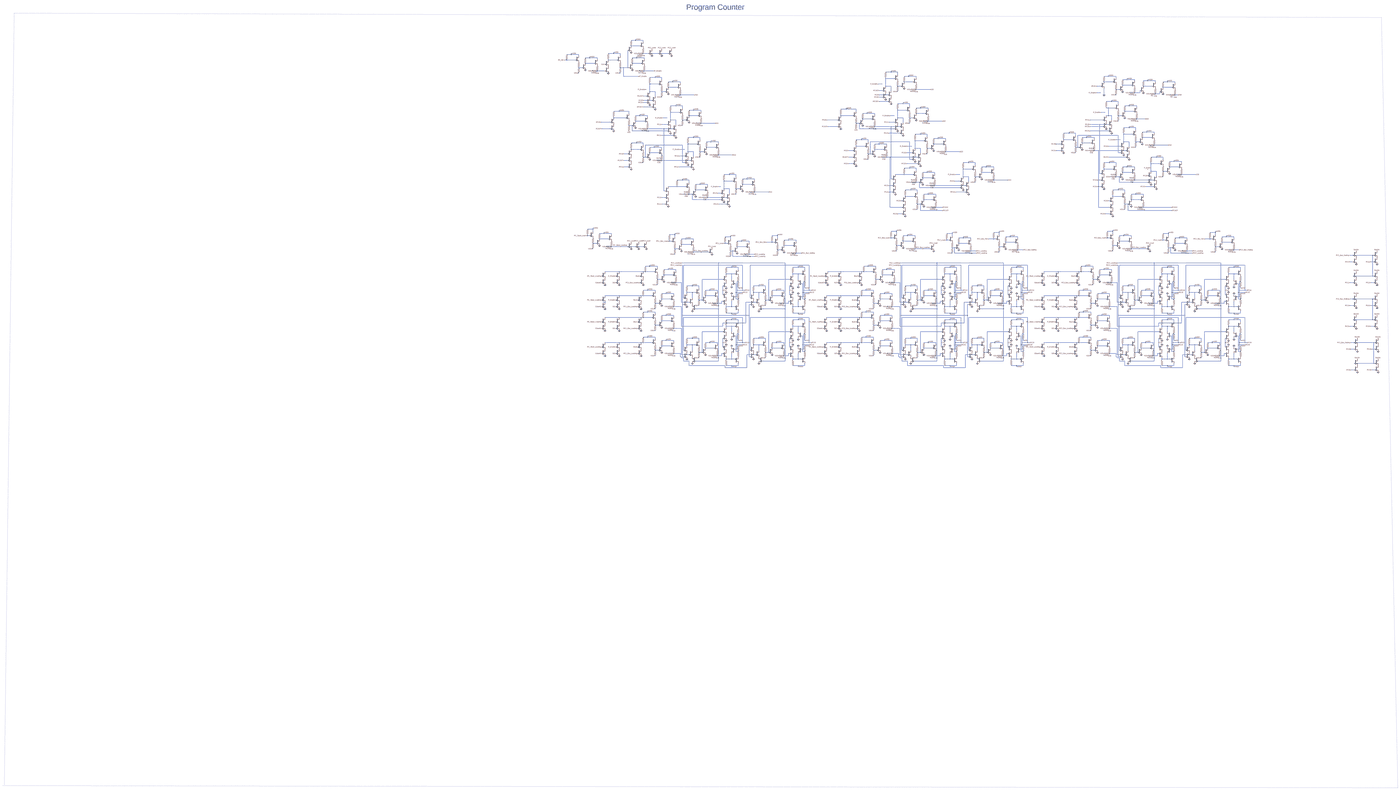
[diagram p0: schematic program_counter.asc, whole sheet]
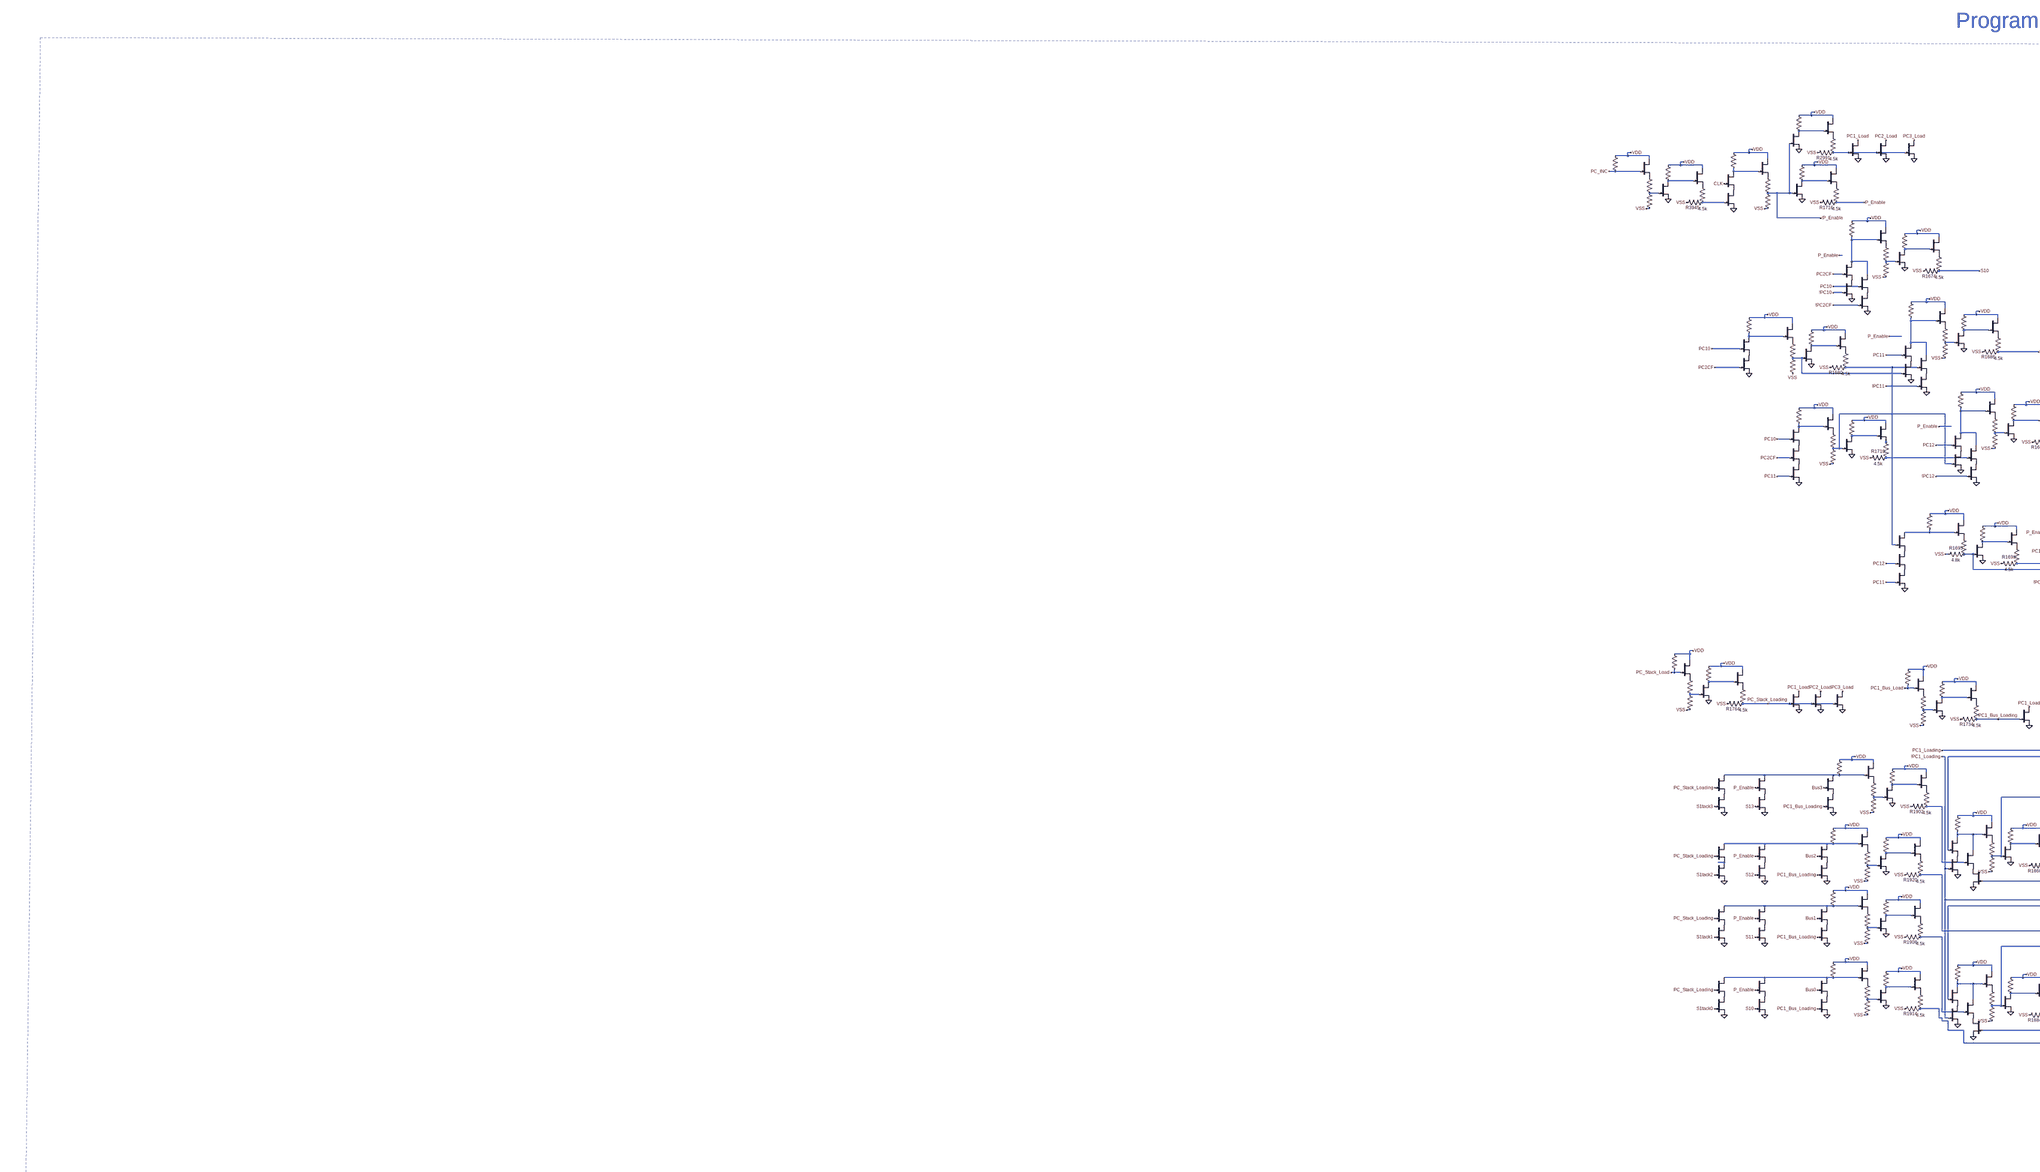
[diagram p1: schematic program_counter.asc, part, row 1 of 2, column 1 of 2]
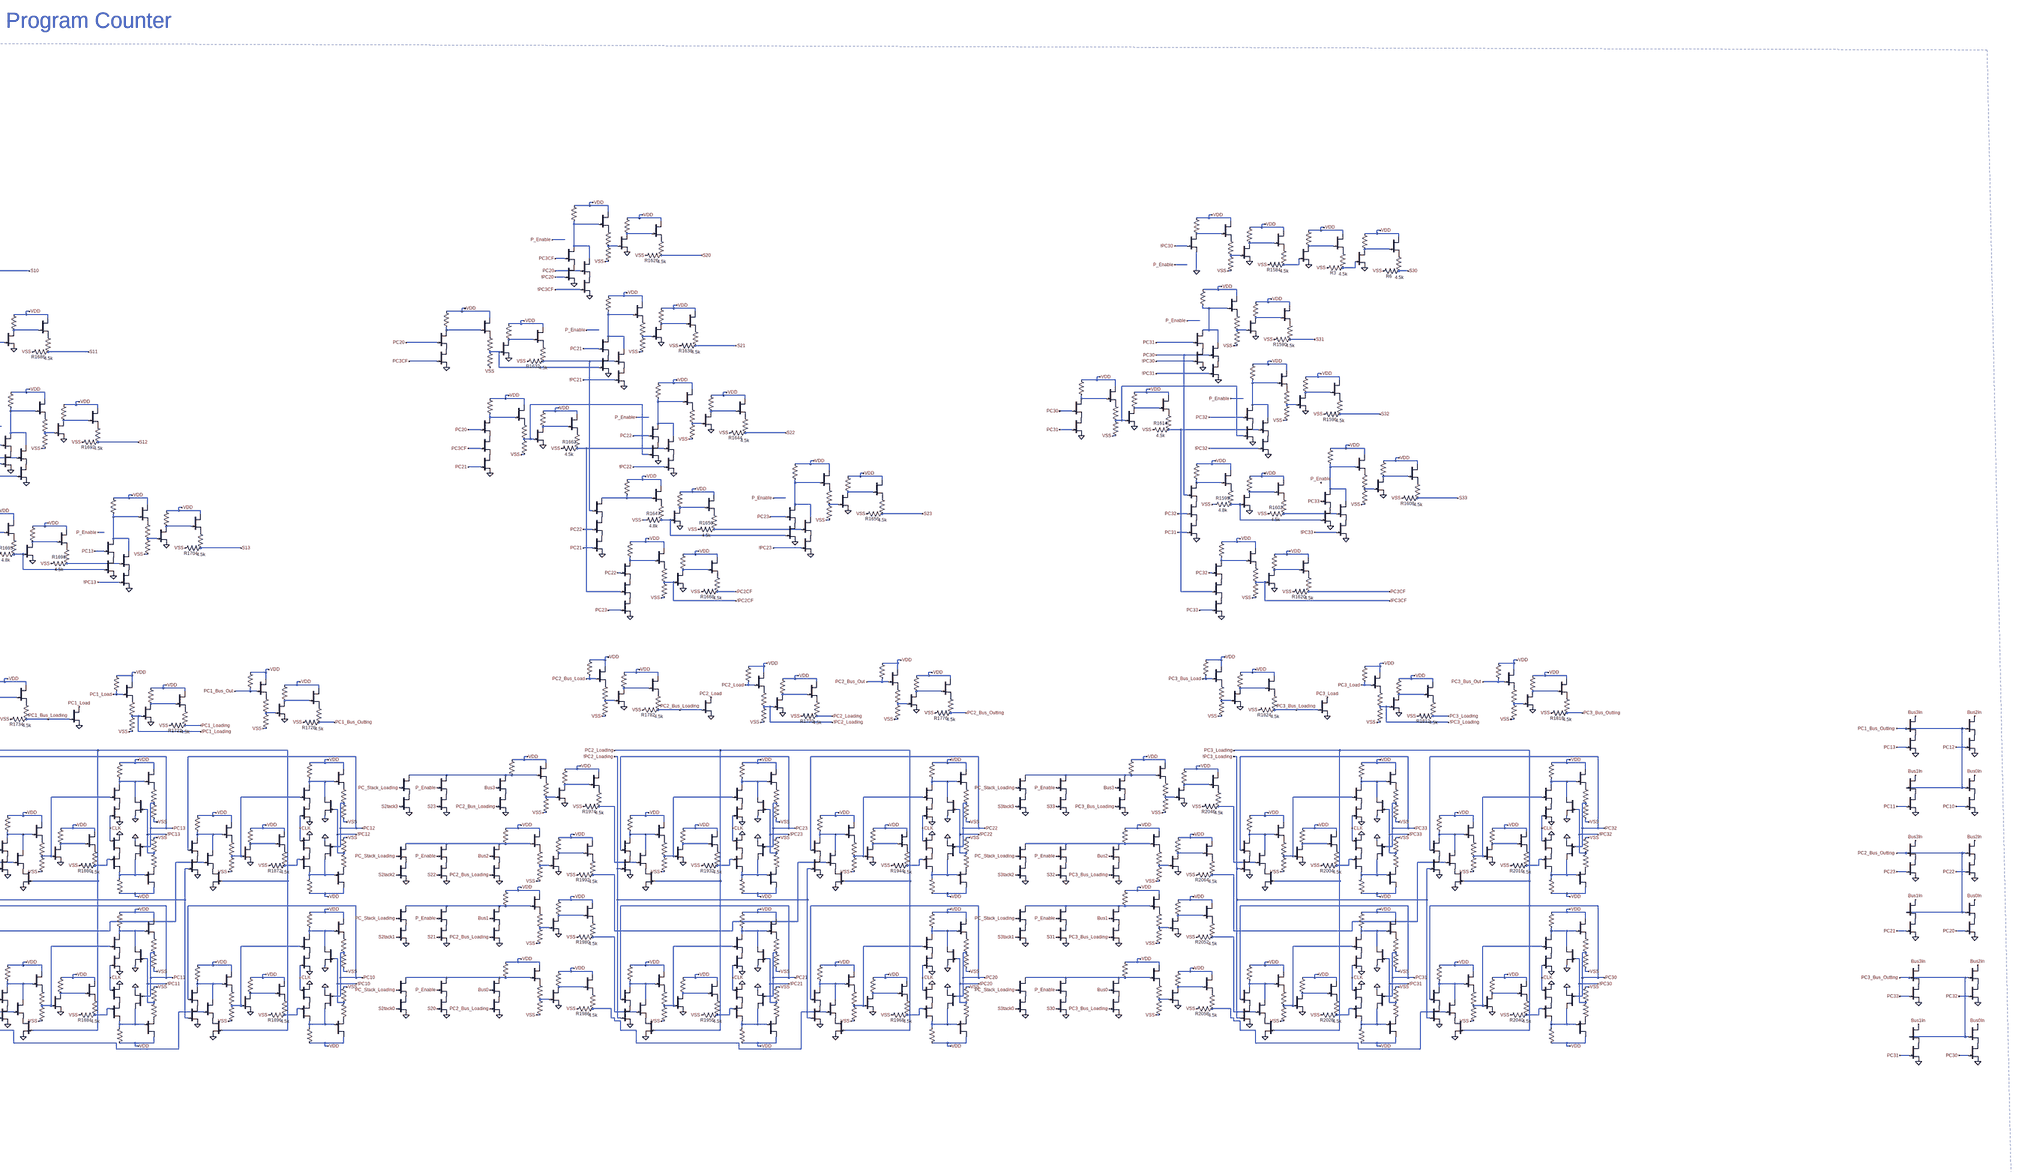
[diagram p2: schematic program_counter.asc, part, row 1 of 2, column 2 of 2]
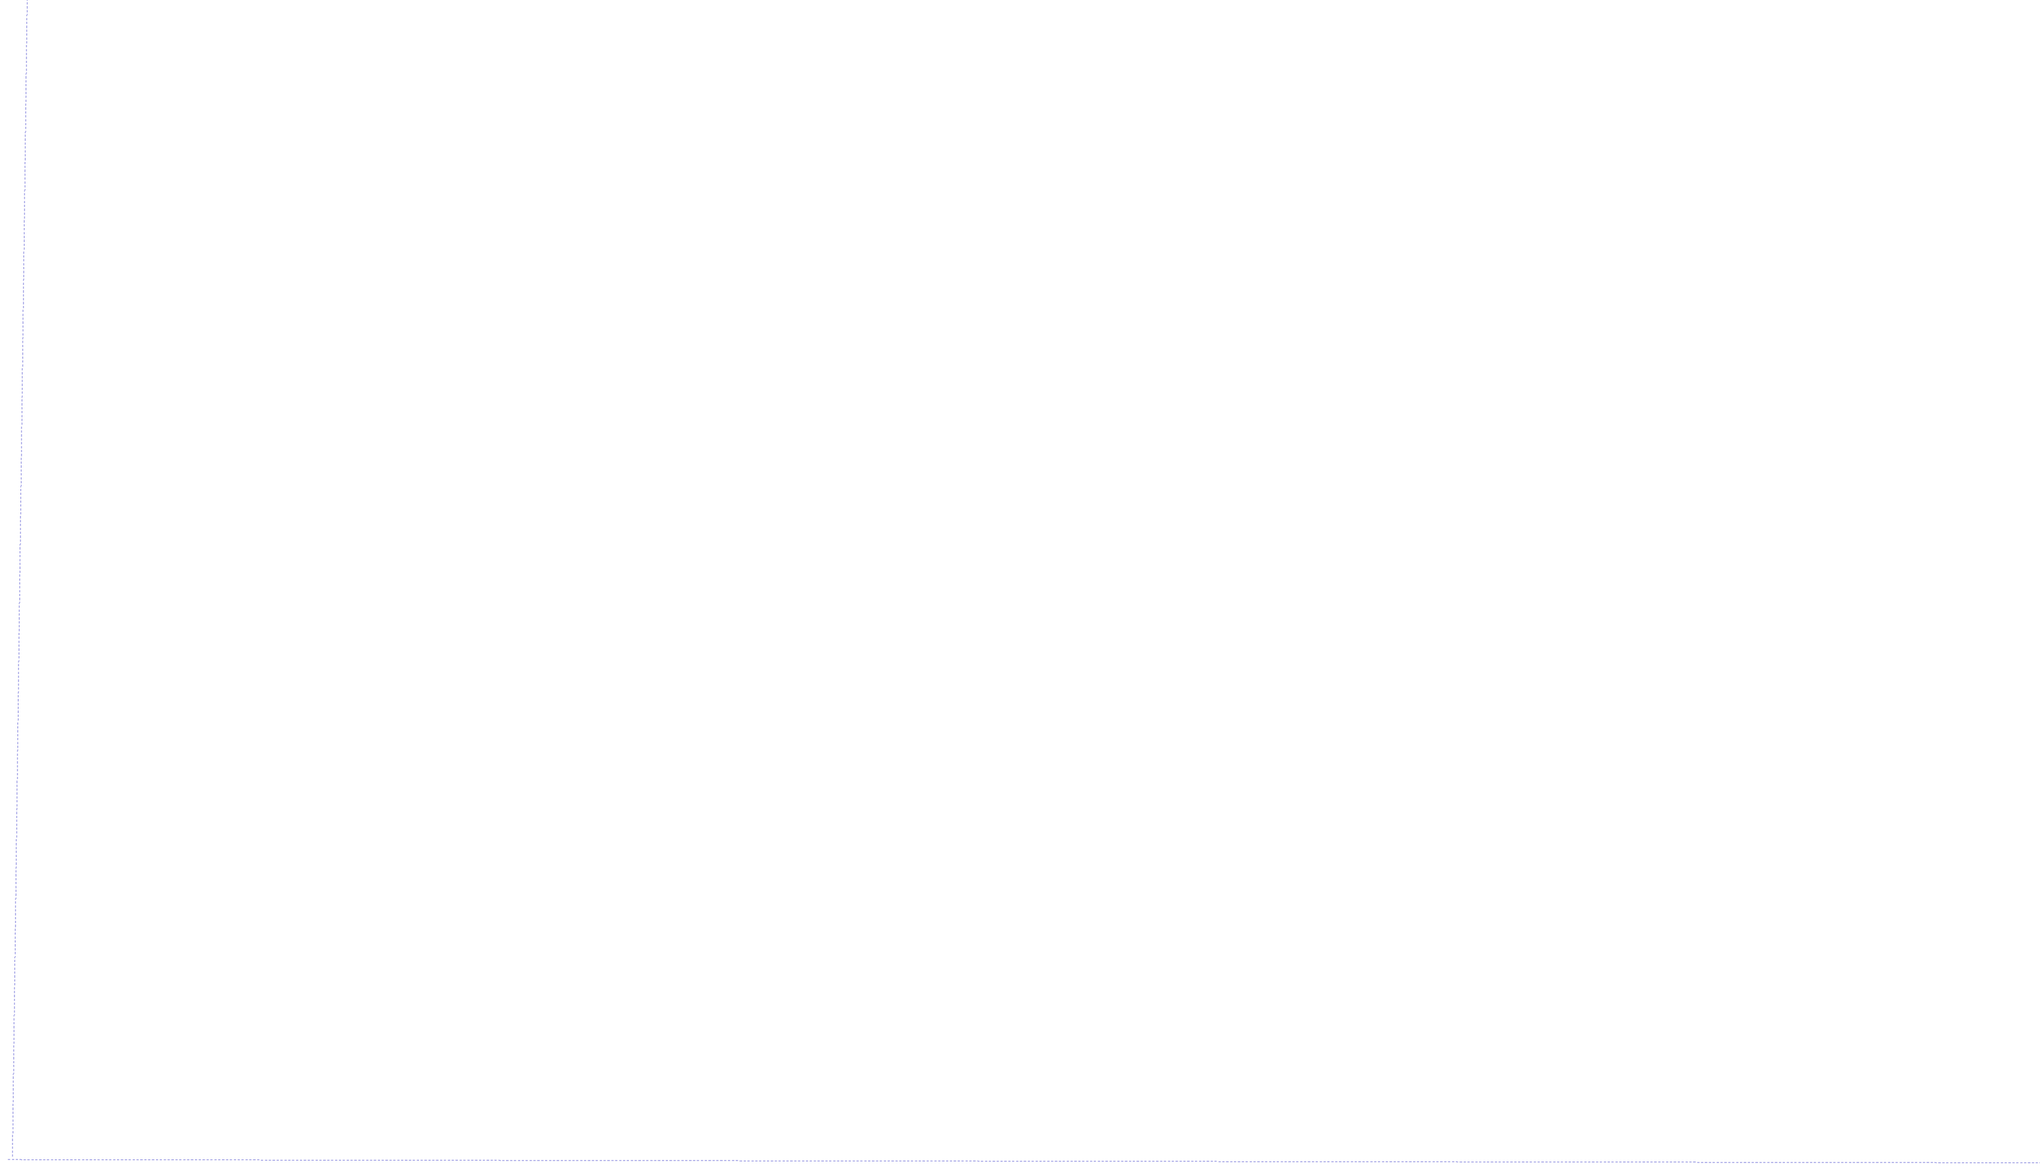
[diagram p3: schematic program_counter.asc, part, row 2 of 2, column 1 of 2]
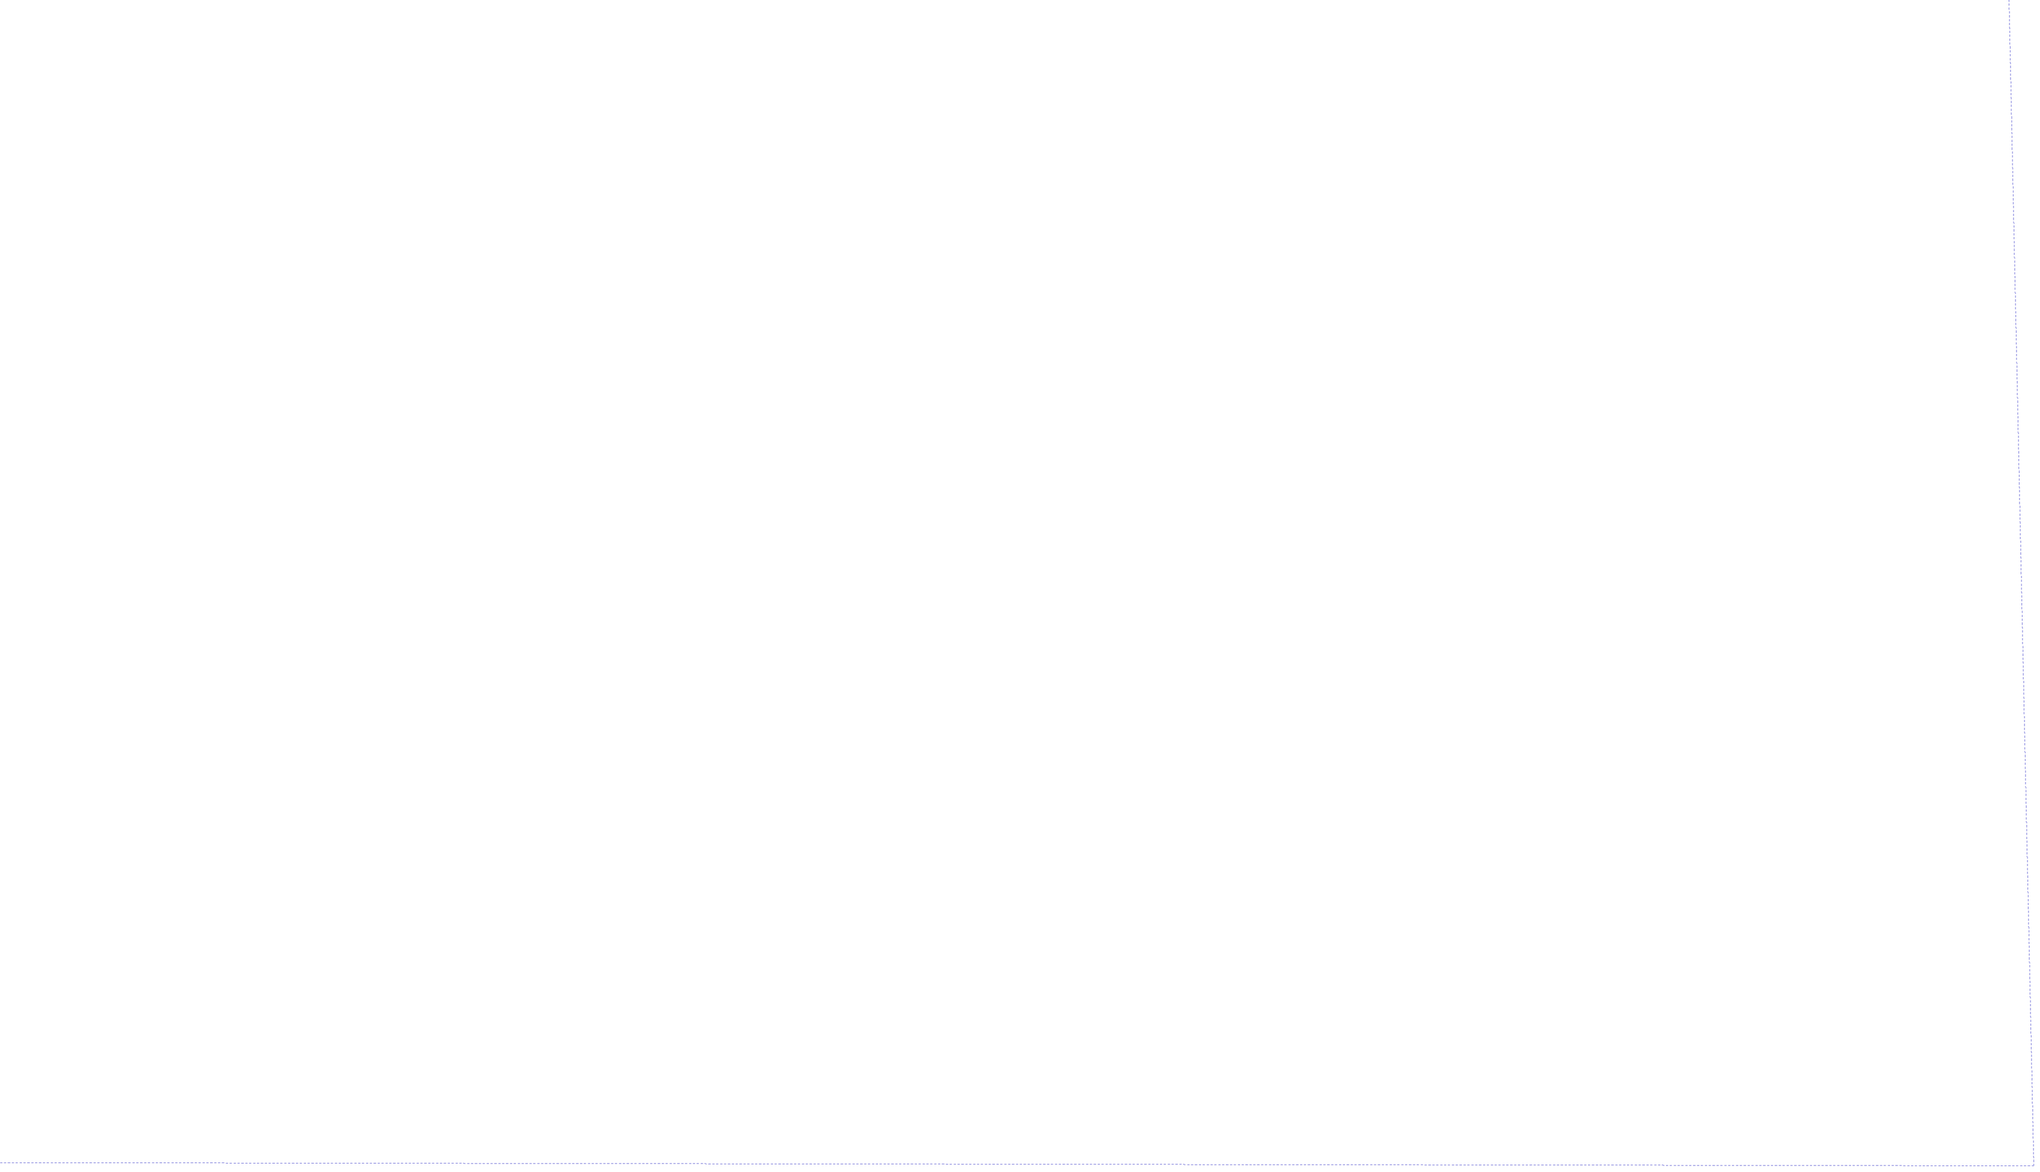
[diagram p4: schematic program_counter.asc, part, row 2 of 2, column 2 of 2]
* program_counter.asc
J_A1039 N010 !PC30 0 DR
R1579 VDD N010 100k
J_F392 VDD N010 P001 DR
R1580 P001 N017 1k
R1581 N017 VSS 4.8k
J_A1040 N012 N017 0 DR
R1582 VDD N012 50k
J_F393 VDD N012 P002 DR
R1583 P002 N019 1k
R1584 N019 VSS 4.5k
J_A1041 N021 PC31 P003 DR
R1585 VDD N021 100k
J_F394 VDD N021 P004 DR
R1586 P004 N028 1k
R1587 N028 VSS 4.8k
J_B497 N021 PC30 P005 DR
J_A1042 N023 N028 0 DR
R1588 VDD N023 50k
J_A1043 VDD N023 P006 DR
R1589 P006 S31 1k
R1590 S31 VSS 4.5k
J_A1044 P003 !PC30 0 DR
J_B498 P005 !PC31 0 DR
J_A1045 N038 PC32 P007 DR
R1591 VDD N038 100k
J_F395 VDD N038 P008 DR
R1592 P008 N044 1k
R1593 N044 VSS 4.8k
J_B499 N038 N054 P009 DR
J_A1046 N040 N044 0 DR
R1594 VDD N040 50k
J_A1047 VDD N040 P010 DR
R1595 P010 S32 1k
R1596 S32 VSS 4.5k
J_A1048 P007 N039 0 DR
J_B500 P009 !PC32 0 DR
R1597 VDD N063 100k
J_F396 VDD N063 P011 DR
R1598 P011 N069 1k
R1599 N069 VSS 4.8k
J_A1049 N066 N069 0 DR
R1600 VDD N066 50k
J_A1050 VDD N066 P012 DR
R1601 P012 N071 1k
R1602 N071 VSS 4.5k
J_A1051 P013 PC31 0 DR
J_B501 P014 PC32 P013 DR
J_B502 N063 PC30 P014 DR
J_A1052 N060 PC33 P015 DR
R1603 VDD N060 100k
J_F397 VDD N060 P016 DR
R1604 P016 N064 1k
R1605 N064 VSS 4.8k
J_B503 N060 N071 P017 DR
J_A1053 N061 N064 0 DR
R1606 VDD N061 50k
J_A1054 VDD N061 P018 DR
R1607 P018 S33 1k
R1608 S33 VSS 4.5k
J_A1055 P015 N069 0 DR
J_B504 P017 !PC33 0 DR
J_A1056 N041 PC30 P019 DR
R1609 VDD N041 100k
J_F398 VDD N041 P020 DR
R1610 P020 N039 1k
R1611 N039 VSS 4.8k
J_A1057 N045 N039 0 DR
R1612 VDD N045 50k
J_A1058 VDD N045 P021 DR
R1613 P021 N054 1k
R1614 N054 VSS 4.5k
J_B505 P019 PC31 0 DR
J_A1059 N081 PC32 P022 DR
J_B506 P022 N054 P023 DR
R1615 VDD N081 100k
J_F399 VDD N081 P024 DR
R1616 P024 !PC3CF 1k
R1617 !PC3CF VSS 4.8k
J_A1060 N084 !PC3CF 0 DR
R1618 VDD N084 50k
J_A1061 VDD N084 P025 DR
R1619 P025 PC3CF 1k
R1620 PC3CF VSS 4.5k
J_B507 P023 PC33 0 DR
J_A1062 N008 PC3CF P026 DR
R1621 VDD N008 100k
J_F400 VDD N008 P027 DR
R1622 P027 N013 1k
R1623 N013 VSS 4.8k
J_B508 N008 PC20 P028 DR
J_A1063 N009 N013 0 DR
R1624 VDD N009 50k
J_A1064 VDD N009 P029 DR
R1625 P029 S20 1k
R1626 S20 VSS 4.5k
J_A1065 P026 !PC20 0 DR
J_B509 P028 !PC3CF 0 DR
R1627 VDD N027 100k
J_F401 VDD N027 P030 DR
R1628 P030 N034 1k
R1629 N034 VSS 4.8k
J_A1066 N031 N034 0 DR
R1630 VDD N031 50k
J_A1067 VDD N031 P031 DR
R1631 P031 N036 1k
R1632 N036 VSS 4.5k
J_B510 N027 PC20 P032 DR
J_B511 P032 PC3CF 0 DR
J_A1068 N022 PC21 P033 DR
R1633 VDD N022 100k
J_F402 VDD N022 P034 DR
R1634 P034 N030 1k
R1635 N030 VSS 4.8k
J_B512 N022 N036 P035 DR
J_A1069 N025 N030 0 DR
R1636 VDD N025 50k
J_A1070 VDD N025 P036 DR
R1637 P036 S21 1k
R1638 S21 VSS 4.5k
J_A1071 P033 N034 0 DR
J_B513 P035 !PC21 0 DR
J_A1072 N042 PC22 P037 DR
R1639 VDD N042 100k
J_F403 VDD N042 P038 DR
R1640 P038 N051 1k
R1641 N051 VSS 4.8k
J_B514 N042 N058 P039 DR
J_A1073 N047 N051 0 DR
R1642 VDD N047 50k
J_A1074 VDD N047 P040 DR
R1643 P040 S22 1k
R1644 S22 VSS 4.5k
J_A1075 P037 N043 0 DR
J_B515 P039 !PC22 0 DR
R1645 VDD N067 100k
J_F404 VDD N067 P041 DR
R1646 P041 N073 1k
R1647 N073 VSS 4.8k
J_A1076 N070 N073 0 DR
R1648 VDD N070 50k
J_A1077 VDD N070 P042 DR
R1649 P042 N075 1k
R1650 N075 VSS 4.5k
J_A1078 P043 PC21 0 DR
J_B516 P044 PC22 P043 DR
J_B517 N067 N036 P044 DR
J_A1079 N062 PC23 P045 DR
R1651 VDD N062 100k
J_F405 VDD N062 P046 DR
R1652 P046 N068 1k
R1653 N068 VSS 4.8k
J_B518 N062 N075 P047 DR
J_A1080 N065 N068 0 DR
R1654 VDD N065 50k
J_A1081 VDD N065 P048 DR
R1655 P048 S23 1k
R1656 S23 VSS 4.5k
J_A1082 P045 N073 0 DR
J_B519 P047 !PC23 0 DR
J_A1083 N049 PC20 P049 DR
J_B520 P049 PC3CF P050 DR
R1657 VDD N049 100k
J_F406 VDD N049 P051 DR
R1658 P051 N043 1k
R1659 N043 VSS 4.8k
J_A1084 N053 N043 0 DR
R1660 VDD N053 50k
J_A1085 VDD N053 P052 DR
R1661 P052 N058 1k
R1662 N058 VSS 4.5k
J_B521 P050 PC21 0 DR
J_A1086 N080 PC22 P053 DR
J_B522 P053 N058 P054 DR
R1663 VDD N080 100k
J_F407 VDD N080 P055 DR
R1664 P055 !PC2CF 1k
R1665 !PC2CF VSS 4.8k
J_A1087 N083 !PC2CF 0 DR
R1666 VDD N083 50k
J_A1088 VDD N083 P056 DR
R1667 P056 PC2CF 1k
R1668 PC2CF VSS 4.5k
J_B523 P054 PC23 0 DR
J_A1089 N011 PC2CF P057 DR
R1669 VDD N011 100k
J_F408 VDD N011 P058 DR
R1670 P058 N018 1k
R1671 N018 VSS 4.8k
J_B524 N011 PC10 P059 DR
J_A1090 N015 N018 0 DR
R1672 VDD N015 50k
J_A1091 VDD N015 P060 DR
R1673 P060 S10 1k
R1674 S10 VSS 4.5k
J_A1092 P057 !PC10 0 DR
J_B525 P059 !PC2CF 0 DR
R1675 VDD N029 100k
J_F409 VDD N029 P061 DR
R1676 P061 N035 1k
R1677 N035 VSS 4.8k
J_A1093 N033 N035 0 DR
R1678 VDD N033 50k
J_A1094 VDD N033 P062 DR
R1679 P062 N037 1k
R1680 N037 VSS 4.5k
J_B526 N029 PC10 P063 DR
J_B527 P063 PC2CF 0 DR
J_A1095 N024 PC11 P064 DR
R1681 VDD N024 100k
J_F410 VDD N024 P065 DR
R1682 P065 N032 1k
R1683 N032 VSS 4.8k
J_B528 N024 N037 P066 DR
J_A1096 N026 N032 0 DR
R1684 VDD N026 50k
J_A1097 VDD N026 P067 DR
R1685 P067 S11 1k
R1686 S11 VSS 4.5k
J_A1098 P064 N035 0 DR
J_B529 P066 !PC11 0 DR
J_A1099 N046 PC12 P068 DR
R1687 VDD N046 100k
J_F411 VDD N046 P069 DR
R1688 P069 N055 1k
R1689 N055 VSS 4.8k
J_B530 N046 N059 P070 DR
J_A1100 N050 N055 0 DR
R1690 VDD N050 50k
J_A1101 VDD N050 P071 DR
R1691 P071 S12 1k
R1692 S12 VSS 4.5k
J_A1102 P068 N048 0 DR
J_B531 P070 !PC12 0 DR
R1693 VDD N076 100k
J_F412 VDD N076 P072 DR
R1694 P072 N079 1k
R1695 N079 VSS 4.8k
J_A1103 N078 N079 0 DR
R1696 VDD N078 50k
J_A1104 VDD N078 P073 DR
R1697 P073 N082 1k
R1698 N082 VSS 4.5k
J_A1105 P074 PC11 0 DR
J_B532 P075 PC12 P074 DR
J_B533 N076 N037 P075 DR
J_A1106 N072 PC13 P076 DR
R1699 VDD N072 100k
J_F413 VDD N072 P077 DR
R1700 P077 N077 1k
R1701 N077 VSS 4.8k
J_B534 N072 N082 P078 DR
J_A1107 N074 N077 0 DR
R1702 VDD N074 50k
J_A1108 VDD N074 P079 DR
R1703 P079 S13 1k
R1704 S13 VSS 4.5k
J_A1109 P076 N079 0 DR
J_B535 P078 !PC13 0 DR
J_A1110 N052 PC10 P080 DR
J_B536 P080 PC2CF P081 DR
R1705 VDD N052 100k
J_F414 VDD N052 P082 DR
R1706 P082 N048 1k
R1707 N048 VSS 4.8k
J_A1111 N056 N048 0 DR
R1708 VDD N056 50k
J_A1112 VDD N056 N057 DR
R1709 N057 N059 1k
R1710 N059 VSS 4.5k
J_B537 P081 PC11 0 DR
R1711 VDD N003 100k
J_F415 VDD N003 P083 DR
R1712 P083 !P_Enable 1k
R1713 !P_Enable VSS 4.8k
J_A1113 PC1_Load N002 0 DR
J_A1114 PC2_Load N002 0 DR
J_A1115 PC3_Load N002 0 DR
J_A1116 N005 !P_Enable 0 DR
R1714 VDD N005 50k
J_A1117 VDD N005 P084 DR
R1715 P084 P_Enable 1k
R1716 P_Enable VSS 4.5k
J_A1118 P085 PC13 0 DR
J_A1119 Bus3In PC1_Bus_Outting P085 DR
J_A1120 P086 PC12 0 DR
J_A1121 Bus2In PC1_Bus_Outting P086 DR
J_A1122 P087 PC11 0 DR
J_A1123 Bus1In PC1_Bus_Outting P087 DR
J_A1124 P088 PC10 0 DR
J_A1125 Bus0In PC1_Bus_Outting P088 DR
J_A1126 P089 PC23 0 DR
J_A1127 Bus3In PC2_Bus_Outting P089 DR
J_A1128 P090 PC22 0 DR
J_A1129 Bus2In PC2_Bus_Outting P090 DR
J_A1130 P091 PC21 0 DR
J_A1131 Bus1In PC2_Bus_Outting P091 DR
J_A1132 P092 PC20 0 DR
J_A1133 Bus0In PC2_Bus_Outting P092 DR
J_A1134 P093 PC33 0 DR
J_A1135 Bus3In PC3_Bus_Outting P093 DR
J_A1136 P094 PC32 0 DR
J_A1137 Bus2In PC3_Bus_Outting P094 DR
J_A1138 P095 PC31 0 DR
J_A1139 Bus1In PC3_Bus_Outting P095 DR
J_A1140 P096 PC30 0 DR
J_A1141 Bus0In PC3_Bus_Outting P096 DR
R1717 VDD PC1_Load 100k
J_F416 VDD PC1_Load P097 DR
R1718 P097 !PC1_Loading 1k
R1719 !PC1_Loading VSS 4.8k
J_A1142 N097 !PC1_Loading 0 DR
R1720 VDD N097 50k
J_A1143 VDD N097 P098 DR
R1721 P098 PC1_Loading 1k
R1722 PC1_Loading VSS 4.5k
R1723 VDD PC1_Bus_Out 100k
J_F417 VDD PC1_Bus_Out P099 DR
R1724 P099 N101 1k
R1725 N101 VSS 4.8k
J_A1144 N094 N101 0 DR
R1726 VDD N094 50k
J_A1145 VDD N094 P100 DR
R1727 P100 PC1_Bus_Outting 1k
R1728 PC1_Bus_Outting VSS 4.5k
R1729 VDD PC1_Bus_Load 100k
J_F418 VDD PC1_Bus_Load P101 DR
R1730 P101 N100 1k
R1731 N100 VSS 4.8k
J_A1146 N093 N100 0 DR
R1732 VDD N093 50k
J_A1147 VDD N093 P102 DR
R1733 P102 PC1_Bus_Loading 1k
R1734 PC1_Bus_Loading VSS 4.5k
J_A1148 PC1_Load PC1_Bus_Loading 0 DR
R1759 VDD PC_Stack_Load 100k
J_F423 VDD PC_Stack_Load P103 DR
R1760 P103 N090 1k
R1761 N090 VSS 4.8k
J_A1157 N085 N090 0 DR
R1762 VDD N085 50k
J_A1158 VDD N085 P104 DR
R1763 P104 PC_Stack_Loading 1k
R1764 PC_Stack_Loading VSS 4.5k
J_A1159 PC1_Load PC_Stack_Loading 0 DR
R1765 VDD PC2_Load 100k
J_F424 VDD PC2_Load P105 DR
R1766 P105 !PC2_Loading 1k
R1767 !PC2_Loading VSS 4.8k
J_A1160 N091 !PC2_Loading 0 DR
R1768 VDD N091 50k
J_A1161 VDD N091 P106 DR
R1769 P106 PC2_Loading 1k
R1770 PC2_Loading VSS 4.5k
R1771 VDD PC2_Bus_Out 100k
J_F425 VDD PC2_Bus_Out P107 DR
R1772 P107 N098 1k
R1773 N098 VSS 4.8k
J_A1162 N088 N098 0 DR
R1774 VDD N088 50k
J_A1163 VDD N088 P108 DR
R1775 P108 PC2_Bus_Outting 1k
R1776 PC2_Bus_Outting VSS 4.5k
R1777 VDD PC2_Bus_Load 100k
J_F426 VDD PC2_Bus_Load P109 DR
R1778 P109 N095 1k
R1779 N095 VSS 4.8k
J_A1164 N086 N095 0 DR
R1780 VDD N086 50k
J_A1165 VDD N086 P110 DR
R1781 P110 PC2_Bus_Loading 1k
R1782 PC2_Bus_Loading VSS 4.5k
J_A1166 PC2_Load PC2_Bus_Loading 0 DR
R1807 VDD PC3_Load 100k
J_F431 VDD PC3_Load P111 DR
R1808 P111 !PC3_Loading 1k
R1809 !PC3_Loading VSS 4.8k
J_A1175 N092 !PC3_Loading 0 DR
R1810 VDD N092 50k
J_A1176 VDD N092 P112 DR
R1811 P112 PC3_Loading 1k
R1812 PC3_Loading VSS 4.5k
R1813 VDD PC3_Bus_Out 100k
J_F432 VDD PC3_Bus_Out P113 DR
R1814 P113 N099 1k
R1815 N099 VSS 4.8k
J_A1177 N089 N099 0 DR
R1816 VDD N089 50k
J_A1178 VDD N089 P114 DR
R1817 P114 PC3_Bus_Outting 1k
R1818 PC3_Bus_Outting VSS 4.5k
R1819 VDD PC3_Bus_Load 100k
J_F433 VDD PC3_Bus_Load P115 DR
R1820 P115 N096 1k
R1821 N096 VSS 4.8k
J_A1179 N087 N096 0 DR
R1822 VDD N087 50k
J_A1180 VDD N087 P116 DR
R1823 P116 PC3_Bus_Loading 1k
R1824 PC3_Bus_Loading VSS 4.5k
J_A1181 PC3_Load PC3_Bus_Loading 0 DR
J_A1190 PC2_Load PC_Stack_Loading 0 DR
J_A1191 PC3_Load PC_Stack_Loading 0 DR
J_A1192 N105 N115 P117 DR
R1849 VDD N105 100k
J_F438 VDD N105 P118 DR
R1850 P118 PC13 1k
R1851 PC13 VSS 4.8k
J_B538 N105 !PC13 0 DR
J_A1193 N157 N144 P119 DR
R1852 VDD N157 100k
J_F439 VDD N157 P120 DR
R1853 P120 !PC13 1k
R1854 !PC13 VSS 4.8k
J_B539 N157 PC13 0 DR
J_A1194 P117 CLK 0 DR
J_A1195 P119 CLK 0 DR
J_A1196 N126 PC13 P121 DR
R1855 VDD N126 100k
J_F440 VDD N126 P122 DR
R1856 P122 N115 1k
R1857 N115 VSS 4.8k
J_B540 N126 N123 P123 DR
J_A1197 N133 N115 0 DR
R1858 VDD N133 50k
J_A1198 VDD N133 P124 DR
R1859 P124 N144 1k
R1860 N144 VSS 4.5k
J_A1199 P121 !PC1_Loading 0 DR
J_B541 P123 PC1_Loading 0 DR
J_A1200 N106 N116 P125 DR
R1861 VDD N106 100k
J_F441 VDD N106 P126 DR
R1862 P126 PC12 1k
R1863 PC12 VSS 4.8k
J_B542 N106 !PC12 0 DR
J_A1201 N158 N145 P127 DR
R1864 VDD N158 100k
J_F442 VDD N158 P128 DR
R1865 P128 !PC12 1k
R1866 !PC12 VSS 4.8k
J_B543 N158 PC12 0 DR
J_A1202 P125 CLK 0 DR
J_A1203 P127 CLK 0 DR
J_A1204 N127 PC12 P129 DR
R1867 VDD N127 100k
J_F443 VDD N127 P130 DR
R1868 P130 N116 1k
R1869 N116 VSS 4.8k
J_B544 N127 N151 P131 DR
J_A1205 N134 N116 0 DR
R1870 VDD N134 50k
J_A1206 VDD N134 P132 DR
R1871 P132 N145 1k
R1872 N145 VSS 4.5k
J_A1207 P129 !PC1_Loading 0 DR
J_B545 P131 PC1_Loading 0 DR
J_A1208 N172 N181 P133 DR
R1873 VDD N172 100k
J_F444 VDD N172 P134 DR
R1874 P134 PC11 1k
R1875 PC11 VSS 4.8k
J_B546 N172 !PC11 0 DR
J_A1209 N217 N209 P135 DR
R1876 VDD N217 100k
J_F445 VDD N217 P136 DR
R1877 P136 !PC11 1k
R1878 !PC11 VSS 4.8k
J_B547 N217 PC11 0 DR
J_A1210 P133 CLK 0 DR
J_A1211 P135 CLK 0 DR
J_A1212 N190 PC11 P137 DR
R1879 VDD N190 100k
J_F446 VDD N190 P138 DR
R1880 P138 N181 1k
R1881 N181 VSS 4.8k
J_B548 N190 N178 P139 DR
J_A1213 N199 N181 0 DR
R1882 VDD N199 50k
J_A1214 VDD N199 P140 DR
R1883 P140 N209 1k
R1884 N209 VSS 4.5k
J_A1215 P137 !PC1_Loading 0 DR
J_B549 P139 PC1_Loading 0 DR
J_A1216 N173 N182 P141 DR
R1885 VDD N173 100k
J_F447 VDD N173 P142 DR
R1886 P142 PC10 1k
R1887 PC10 VSS 4.8k
J_B550 N173 !PC10 0 DR
J_A1217 N218 N210 P143 DR
R1888 VDD N218 100k
J_F448 VDD N218 P144 DR
R1889 P144 !PC10 1k
R1890 !PC10 VSS 4.8k
J_B551 N218 PC10 0 DR
J_A1218 P141 CLK 0 DR
J_A1219 P143 CLK 0 DR
J_A1220 N191 PC10 P145 DR
R1891 VDD N191 100k
J_F449 VDD N191 P146 DR
R1892 P146 N182 1k
R1893 N182 VSS 4.8k
J_B552 N191 N208 P147 DR
J_A1221 N200 N182 0 DR
R1894 VDD N200 50k
J_A1222 VDD N200 P148 DR
R1895 P148 N210 1k
R1896 N210 VSS 4.5k
J_A1223 P145 !PC1_Loading 0 DR
J_B553 P147 PC1_Loading 0 DR
J_A1224 N102 Bus3 P149 DR
R1897 VDD N102 100k
J_F450 VDD N102 P150 DR
R1898 P150 N114 1k
R1899 N114 VSS 4.8k
J_B554 P149 PC1_Bus_Loading 0 DR
J_A1225 N111 N114 0 DR
R1900 VDD N111 50k
J_F451 VDD N111 P151 DR
R1901 P151 N123 1k
R1902 N123 VSS 4.5k
J_A1226 N163 Bus1 P152 DR
R1903 VDD N163 100k
J_F452 VDD N163 P153 DR
R1904 P153 N169 1k
R1905 N169 VSS 4.8k
J_B555 P152 PC1_Bus_Loading 0 DR
J_A1227 N166 N169 0 DR
R1906 VDD N166 50k
J_F453 VDD N166 P154 DR
R1907 P154 N178 1k
R1908 N178 VSS 4.5k
J_A1228 N187 Bus0 P155 DR
R1909 VDD N187 100k
J_F454 VDD N187 P156 DR
R1910 P156 N205 1k
R1911 N205 VSS 4.8k
J_B556 P155 PC1_Bus_Loading 0 DR
J_A1229 N196 N205 0 DR
R1912 VDD N196 50k
J_F455 VDD N196 P157 DR
R1913 P157 N208 1k
R1914 N208 VSS 4.5k
J_A1230 N132 Bus2 P158 DR
R1915 VDD N132 100k
J_F456 VDD N132 P159 DR
R1916 P159 N154 1k
R1917 N154 VSS 4.8k
J_B557 P158 PC1_Bus_Loading 0 DR
J_A1231 N141 N154 0 DR
R1918 VDD N141 50k
J_F457 VDD N141 P160 DR
R1919 P160 N151 1k
R1920 N151 VSS 4.5k
J_A1232 N102 PC_Stack_Loading P161 DR
J_B558 P161 S1tack3 0 DR
J_A1233 N132 PC_Stack_Loading N150 DR
J_B559 N150 S1tack2 0 DR
J_A1234 N163 PC_Stack_Loading P162 DR
J_B560 P162 S1tack1 0 DR
J_A1235 N187 PC_Stack_Loading P163 DR
J_B561 P163 S1tack0 0 DR
J_A1236 N102 P_Enable P164 DR
J_B562 P164 S13 0 DR
J_A1237 N132 P_Enable P165 DR
J_B563 P165 S12 0 DR
J_A1238 N163 P_Enable P166 DR
J_B564 P166 S11 0 DR
J_A1239 N187 P_Enable P167 DR
J_B565 P167 S10 0 DR
J_A1240 N107 N118 P168 DR
R1921 VDD N107 100k
J_F458 VDD N107 P169 DR
R1922 P169 PC23 1k
R1923 PC23 VSS 4.8k
J_B566 N107 !PC23 0 DR
J_A1241 N159 N146 P170 DR
R1924 VDD N159 100k
J_F459 VDD N159 P171 DR
R1925 P171 !PC23 1k
R1926 !PC23 VSS 4.8k
J_B567 N159 PC23 0 DR
J_A1242 P168 CLK 0 DR
J_A1243 P170 CLK 0 DR
J_A1244 N128 PC23 P172 DR
R1927 VDD N128 100k
J_F460 VDD N128 P173 DR
R1928 P173 N118 1k
R1929 N118 VSS 4.8k
J_B568 N128 N124 P174 DR
J_A1245 N136 N118 0 DR
R1930 VDD N136 50k
J_A1246 VDD N136 P175 DR
R1931 P175 N146 1k
R1932 N146 VSS 4.5k
J_A1247 P172 !PC2_Loading 0 DR
J_B569 P174 PC2_Loading 0 DR
J_A1248 N108 N119 P176 DR
R1933 VDD N108 100k
J_F461 VDD N108 P177 DR
R1934 P177 PC22 1k
R1935 PC22 VSS 4.8k
J_B570 N108 !PC22 0 DR
J_A1249 N160 N147 P178 DR
R1936 VDD N160 100k
J_F462 VDD N160 P179 DR
R1937 P179 !PC22 1k
R1938 !PC22 VSS 4.8k
J_B571 N160 PC22 0 DR
J_A1250 P176 CLK 0 DR
J_A1251 P178 CLK 0 DR
J_A1252 N129 PC22 P180 DR
R1939 VDD N129 100k
J_F463 VDD N129 P181 DR
R1940 P181 N119 1k
R1941 N119 VSS 4.8k
J_B572 N129 N152 P182 DR
J_A1253 N137 N119 0 DR
R1942 VDD N137 50k
J_A1254 VDD N137 P183 DR
R1943 P183 N147 1k
R1944 N147 VSS 4.5k
J_A1255 P180 !PC2_Loading 0 DR
J_B573 P182 PC2_Loading 0 DR
J_A1256 N174 N183 P184 DR
R1945 VDD N174 100k
J_F464 VDD N174 P185 DR
R1946 P185 PC21 1k
R1947 PC21 VSS 4.8k
J_B574 N174 !PC21 0 DR
J_A1257 N219 N212 P186 DR
R1948 VDD N219 100k
J_F465 VDD N219 P187 DR
R1949 P187 !PC21 1k
R1950 !PC21 VSS 4.8k
J_B575 N219 PC21 0 DR
J_A1258 P184 CLK 0 DR
J_A1259 P186 CLK 0 DR
J_A1260 N192 PC21 P188 DR
R1951 VDD N192 100k
J_F466 VDD N192 P189 DR
R1952 P189 N183 1k
R1953 N183 VSS 4.8k
J_B576 N192 N179 P190 DR
J_A1261 N201 N183 0 DR
R1954 VDD N201 50k
J_A1262 VDD N201 P191 DR
R1955 P191 N212 1k
R1956 N212 VSS 4.5k
J_A1263 P188 !PC2_Loading 0 DR
J_B577 P190 PC2_Loading 0 DR
J_A1264 N175 N184 P192 DR
R1957 VDD N175 100k
J_F467 VDD N175 P193 DR
R1958 P193 PC20 1k
R1959 PC20 VSS 4.8k
J_B578 N175 !PC20 0 DR
J_A1265 N220 N213 P194 DR
R1960 VDD N220 100k
J_F468 VDD N220 P195 DR
R1961 P195 !PC20 1k
R1962 !PC20 VSS 4.8k
J_B579 N220 PC20 0 DR
J_A1266 P192 CLK 0 DR
J_A1267 P194 CLK 0 DR
J_A1268 N193 PC20 P196 DR
R1963 VDD N193 100k
J_F469 VDD N193 P197 DR
R1964 P197 N184 1k
R1965 N184 VSS 4.8k
J_B580 N193 N211 P198 DR
J_A1269 N202 N184 0 DR
R1966 VDD N202 50k
J_A1270 VDD N202 P199 DR
R1967 P199 N213 1k
R1968 N213 VSS 4.5k
J_A1271 P196 !PC2_Loading 0 DR
J_B581 P198 PC2_Loading 0 DR
J_A1272 N103 Bus3 P200 DR
R1969 VDD N103 100k
J_F470 VDD N103 P201 DR
R1970 P201 N117 1k
R1971 N117 VSS 4.8k
J_B582 P200 PC2_Bus_Loading 0 DR
J_A1273 N112 N117 0 DR
R1972 VDD N112 50k
J_F471 VDD N112 P202 DR
R1973 P202 N124 1k
R1974 N124 VSS 4.5k
J_A1274 N164 Bus1 P203 DR
R1975 VDD N164 100k
J_F472 VDD N164 P204 DR
R1976 P204 N170 1k
R1977 N170 VSS 4.8k
J_B583 P203 PC2_Bus_Loading 0 DR
J_A1275 N167 N170 0 DR
R1978 VDD N167 50k
J_F473 VDD N167 P205 DR
R1979 P205 N179 1k
R1980 N179 VSS 4.5k
J_A1276 N188 Bus0 P206 DR
R1981 VDD N188 100k
J_F474 VDD N188 P207 DR
R1982 P207 N206 1k
R1983 N206 VSS 4.8k
J_B584 P206 PC2_Bus_Loading 0 DR
J_A1277 N197 N206 0 DR
R1984 VDD N197 50k
J_F475 VDD N197 P208 DR
R1985 P208 N211 1k
R1986 N211 VSS 4.5k
J_A1278 N135 Bus2 P209 DR
R1987 VDD N135 100k
J_F476 VDD N135 P210 DR
R1988 P210 N155 1k
R1989 N155 VSS 4.8k
J_B585 P209 PC2_Bus_Loading 0 DR
J_A1279 N142 N155 0 DR
R1990 VDD N142 50k
J_F477 VDD N142 P211 DR
R1991 P211 N152 1k
R1992 N152 VSS 4.5k
J_A1280 N103 PC_Stack_Loading P212 DR
J_B586 P212 S2tack3 0 DR
J_A1281 N135 PC_Stack_Loading P213 DR
J_B587 P213 S2tack2 0 DR
J_A1282 N164 PC_Stack_Loading P214 DR
J_B588 P214 S2tack1 0 DR
J_A1283 N188 PC_Stack_Loading P215 DR
J_B589 P215 S2tack0 0 DR
J_A1284 N109 N121 P216 DR
R1993 VDD N109 100k
J_F478 VDD N109 P217 DR
R1994 P217 PC33 1k
R1995 PC33 VSS 4.8k
J_B590 N109 !PC33 0 DR
J_A1285 N161 N148 P218 DR
R1996 VDD N161 100k
J_F479 VDD N161 P219 DR
R1997 P219 !PC33 1k
R1998 !PC33 VSS 4.8k
J_B591 N161 PC33 0 DR
J_A1286 P216 CLK 0 DR
J_A1287 P218 CLK 0 DR
J_A1288 N130 PC33 P220 DR
R1999 VDD N130 100k
J_F480 VDD N130 P221 DR
R2000 P221 N121 1k
R2001 N121 VSS 4.8k
J_B592 N130 N125 P222 DR
J_A1289 N139 N121 0 DR
R2002 VDD N139 50k
J_A1290 VDD N139 P223 DR
R2003 P223 N148 1k
R2004 N148 VSS 4.5k
J_A1291 P220 !PC3_Loading 0 DR
J_B593 P222 PC3_Loading 0 DR
J_A1292 N110 N122 P224 DR
R2005 VDD N110 100k
J_F481 VDD N110 P225 DR
R2006 P225 PC32 1k
R2007 PC32 VSS 4.8k
J_B594 N110 !PC32 0 DR
J_A1293 N162 N149 P226 DR
R2008 VDD N162 100k
J_F482 VDD N162 P227 DR
R2009 P227 !PC32 1k
R2010 !PC32 VSS 4.8k
J_B595 N162 PC32 0 DR
J_A1294 P224 CLK 0 DR
J_A1295 P226 CLK 0 DR
J_A1296 N131 PC32 P228 DR
R2011 VDD N131 100k
J_F483 VDD N131 P229 DR
R2012 P229 N122 1k
R2013 N122 VSS 4.8k
J_B596 N131 N153 P230 DR
J_A1297 N140 N122 0 DR
R2014 VDD N140 50k
J_A1298 VDD N140 P231 DR
R2015 P231 N149 1k
R2016 N149 VSS 4.5k
J_A1299 P228 !PC3_Loading 0 DR
J_B597 P230 PC3_Loading 0 DR
J_A1300 N176 N185 P232 DR
R2017 VDD N176 100k
J_F484 VDD N176 P233 DR
R2018 P233 PC31 1k
R2019 PC31 VSS 4.8k
J_B598 N176 !PC31 0 DR
J_A1301 N221 N215 P234 DR
R2020 VDD N221 100k
J_F485 VDD N221 P235 DR
R2021 P235 !PC31 1k
R2022 !PC31 VSS 4.8k
J_B599 N221 PC31 0 DR
J_A1302 P232 CLK 0 DR
J_A1303 P234 CLK 0 DR
J_A1304 N194 PC31 P236 DR
R2023 VDD N194 100k
J_F486 VDD N194 P237 DR
R2024 P237 N185 1k
R2025 N185 VSS 4.8k
J_B600 N194 N180 P238 DR
J_A1305 N203 N185 0 DR
R2026 VDD N203 50k
J_A1306 VDD N203 P239 DR
R2027 P239 N215 1k
R2028 N215 VSS 4.5k
J_A1307 P236 !PC3_Loading 0 DR
J_B601 P238 PC3_Loading 0 DR
J_A1308 N177 N186 P240 DR
R2029 VDD N177 100k
J_F487 VDD N177 P241 DR
R2030 P241 PC30 1k
R2031 PC30 VSS 4.8k
J_B602 N177 !PC30 0 DR
J_A1309 N222 N216 P242 DR
R2032 VDD N222 100k
J_F488 VDD N222 P243 DR
R2033 P243 !PC30 1k
R2034 !PC30 VSS 4.8k
J_B603 N222 PC30 0 DR
J_A1310 P240 CLK 0 DR
J_A1311 P242 CLK 0 DR
J_A1312 N195 PC30 P244 DR
R2035 VDD N195 100k
J_F489 VDD N195 P245 DR
R2036 P245 N186 1k
R2037 N186 VSS 4.8k
J_B604 N195 N214 P246 DR
J_A1313 N204 N186 0 DR
R2038 VDD N204 50k
J_A1314 VDD N204 P247 DR
R2039 P247 N216 1k
R2040 N216 VSS 4.5k
J_A1315 P244 !PC3_Loading 0 DR
J_B605 P246 PC3_Loading 0 DR
J_A1316 N104 Bus3 P248 DR
R2041 VDD N104 100k
J_F490 VDD N104 P249 DR
R2042 P249 N120 1k
R2043 N120 VSS 4.8k
J_B606 P248 PC3_Bus_Loading 0 DR
J_A1317 N113 N120 0 DR
R2044 VDD N113 50k
J_F491 VDD N113 P250 DR
R2045 P250 N125 1k
R2046 N125 VSS 4.5k
J_A1318 N165 Bus1 P251 DR
R2047 VDD N165 100k
J_F492 VDD N165 P252 DR
R2048 P252 N171 1k
R2049 N171 VSS 4.8k
J_B607 P251 PC3_Bus_Loading 0 DR
J_A1319 N168 N171 0 DR
R2050 VDD N168 50k
J_F493 VDD N168 P253 DR
R2051 P253 N180 1k
R2052 N180 VSS 4.5k
J_A1320 N189 Bus0 P254 DR
R2053 VDD N189 100k
J_F494 VDD N189 P255 DR
R2054 P255 N207 1k
R2055 N207 VSS 4.8k
J_B608 P254 PC3_Bus_Loading 0 DR
J_A1321 N198 N207 0 DR
R2056 VDD N198 50k
J_F495 VDD N198 P256 DR
R2057 P256 N214 1k
R2058 N214 VSS 4.5k
J_A1322 N138 Bus2 P257 DR
R2059 VDD N138 100k
J_F496 VDD N138 P258 DR
R2060 P258 N156 1k
R2061 N156 VSS 4.8k
J_B609 P257 PC3_Bus_Loading 0 DR
J_A1323 N143 N156 0 DR
R2062 VDD N143 50k
J_F497 VDD N143 P259 DR
R2063 P259 N153 1k
R2064 N153 VSS 4.5k
J_A1324 N104 PC_Stack_Loading P260 DR
J_B610 P260 S3tack3 0 DR
J_A1325 N138 PC_Stack_Loading P261 DR
J_B611 P261 S3tack2 0 DR
J_A1326 N165 PC_Stack_Loading P262 DR
J_B612 P262 S3tack1 0 DR
J_A1327 N189 PC_Stack_Loading P263 DR
J_B613 P263 S3tack0 0 DR
J_A1328 N103 P_Enable P264 DR
J_B614 P264 S23 0 DR
J_A1329 N135 P_Enable P265 DR
J_B615 P265 S22 0 DR
J_A1330 N164 P_Enable P266 DR
J_B616 P266 S21 0 DR
J_A1331 N188 P_Enable P267 DR
J_B617 P267 S20 0 DR
J_A1332 N104 P_Enable P268 DR
J_B618 P268 S33 0 DR
J_A1333 N138 P_Enable P269 DR
J_B619 P269 S32 0 DR
J_A1334 N165 P_Enable P270 DR
J_B620 P270 S31 0 DR
J_A1335 N189 P_Enable P271 DR
J_B621 P271 S30 0 DR
J_A1336 N003 CLK P272 DR
J_A1913 N001 !P_Enable 0 DR
R2989 VDD N001 50k
J_A1914 VDD N001 P273 DR
R2990 P273 N002 1k
R2991 N002 VSS 4.5k
R3940 VDD PC_INC 100k
J_F995 VDD PC_INC P274 DR
R3941 P274 N006 1k
R3942 N006 VSS 4.8k
J_A2425 N004 N006 0 DR
R3943 VDD N004 50k
J_F996 VDD N004 P275 DR
R3944 P275 N007 1k
R3945 N007 VSS 4.5k
J_A2426 P272 N007 0 DR
J_A1 N014 N019 0 DR
R1 VDD N014 50k
J_F1 VDD N014 P276 DR
R2 P276 N020 1k
R3 N020 VSS 4.5k
J_A2 N016 N020 0 DR
R4 VDD N016 50k
J_F2 VDD N016 P277 DR
R5 P277 S30 1k
R6 S30 VSS 4.5k
.model NJF NJF
.model PJF PJF
.lib standard.jft
* Program Counter
.backanno
.end